# Altium schematic sheet DE-130817_02.SchDoc: Digital Input & Relay Out
size A3; Author: eldar6776@hotmail.com; DrawnBy: Eldar Dedic; Organization: I-MEDIA GROUP d.o.o.; Address1: Topal Osman Paše 18; Address2: 71000 Sarajevo; Address3: Federacija BiH; Address4: Bosna i Hercegovina; DocumentNumber: DE-130817; Revision: 001
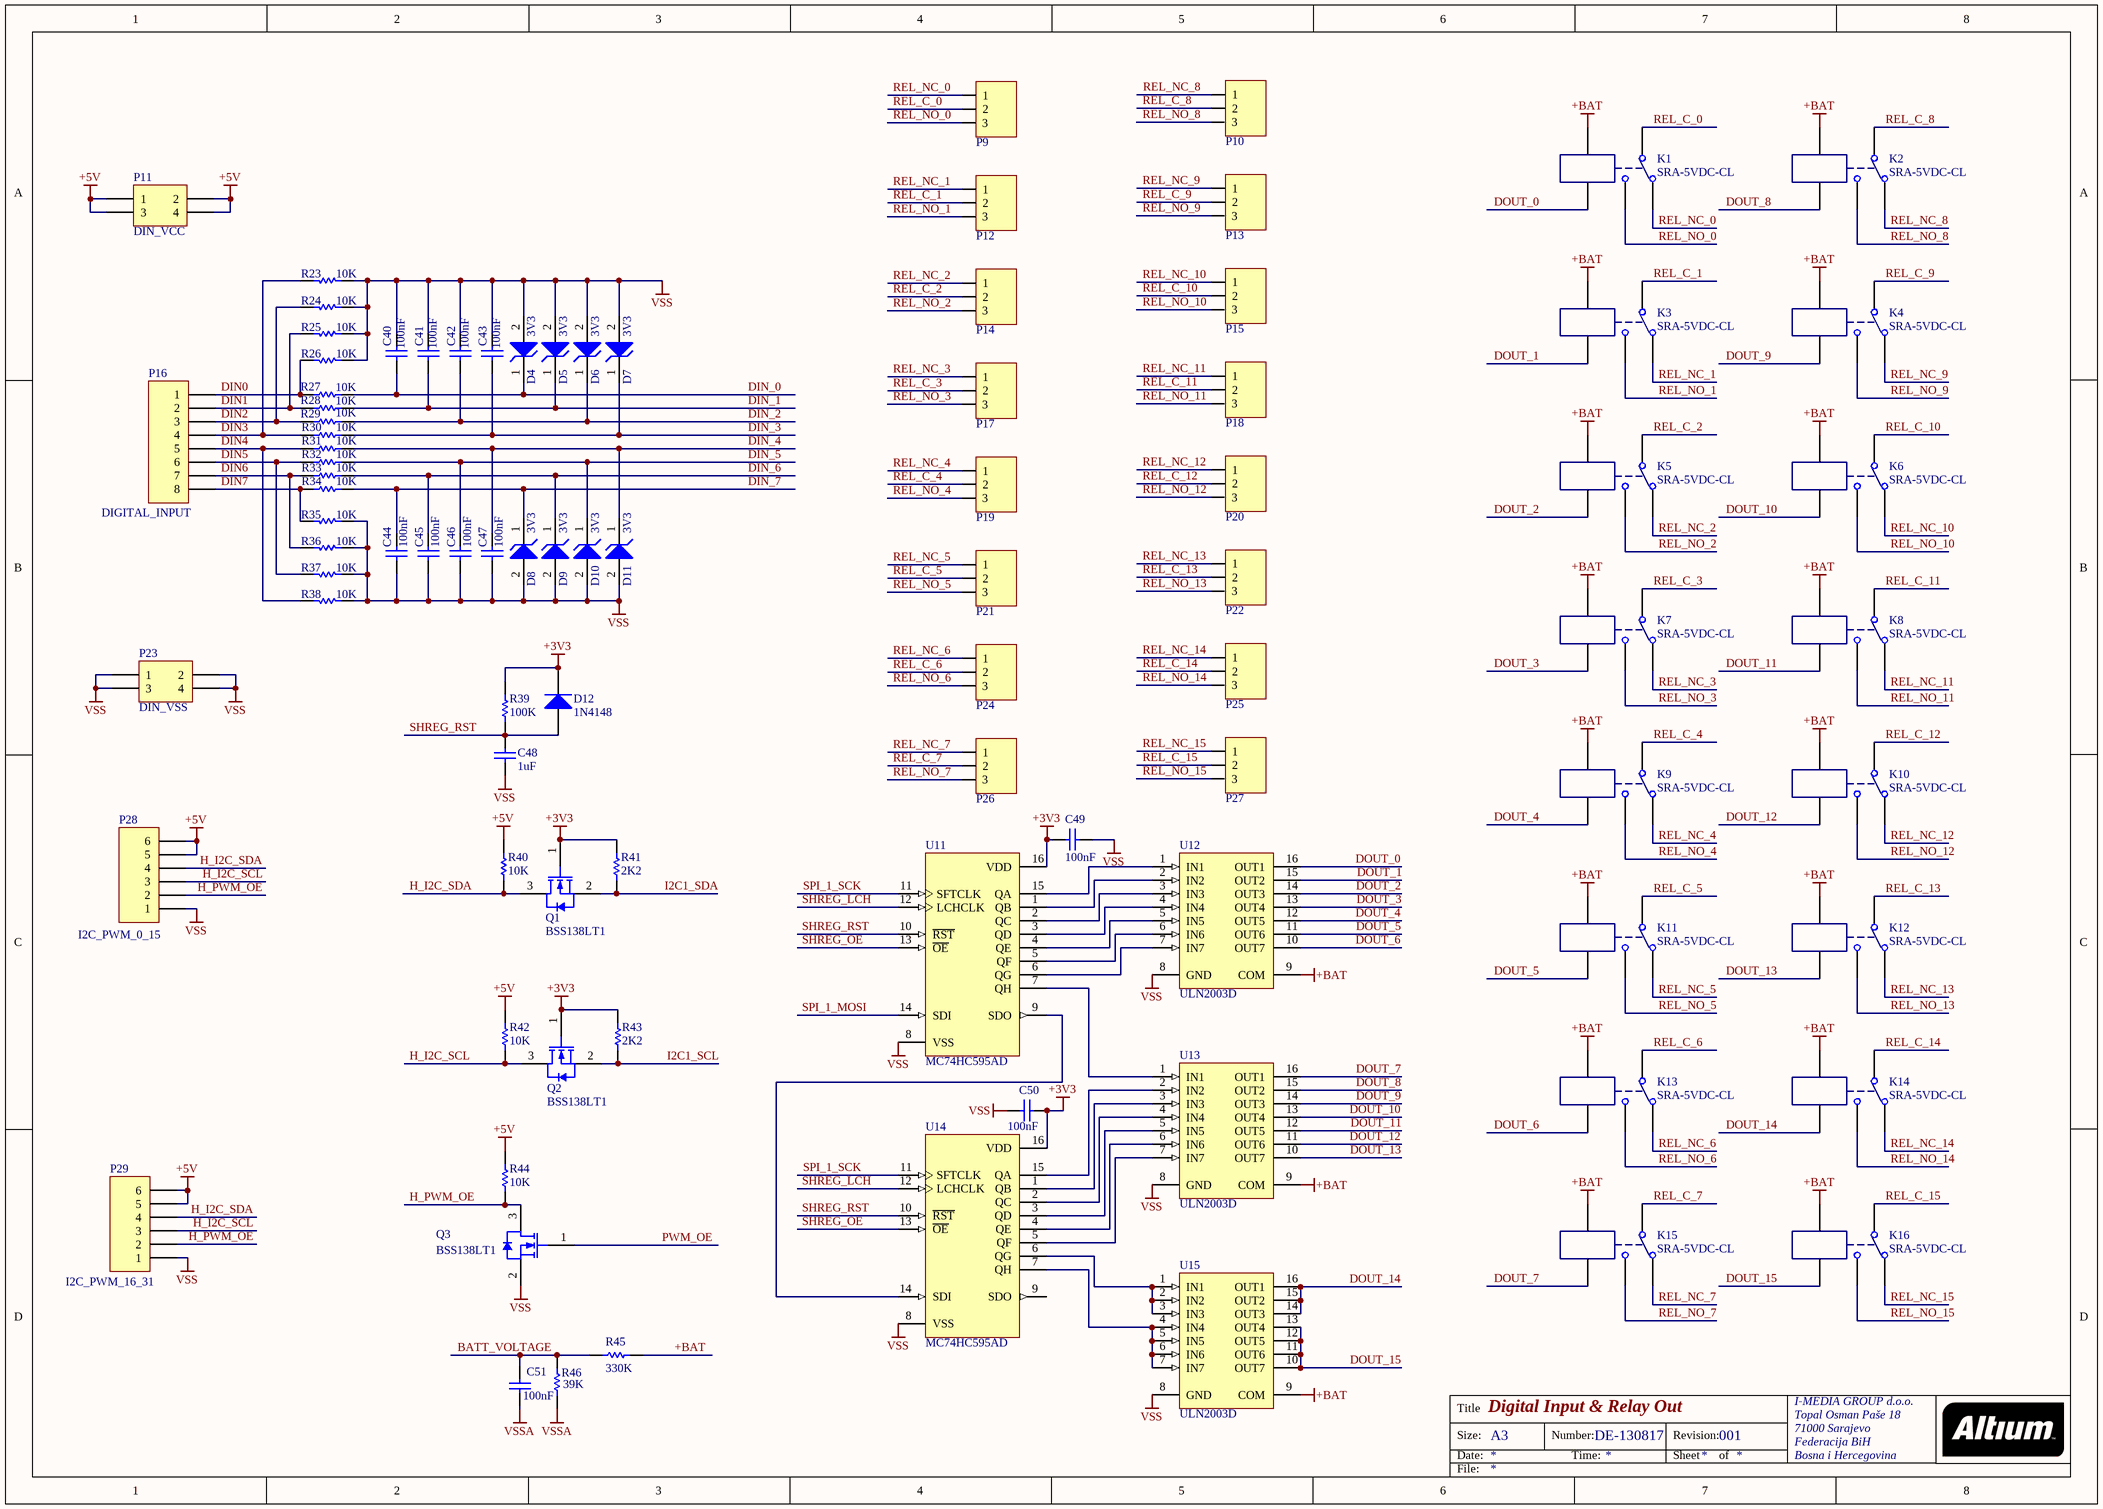
[diagram p0: DE-130817_02.SchDoc]

## Parts
C40  100nF  [0603]
C41  100nF  [0603]
C42  100nF  [0603]
C43  100nF  [0603]
C44  100nF  [0603]
C45  100nF  [0603]
C46  100nF  [0603]
C47  100nF  [0603]
C48  1uF  [0603]
C49  100nF  [0603]
C50  100nF  [0603]
C51  100nF  [0603]
D4  3V3  [ONSC-SOD-323-2-477-02_V]
D5  3V3  [ONSC-SOD-323-2-477-02_V]
D6  3V3  [ONSC-SOD-323-2-477-02_V]
D7  3V3  [ONSC-SOD-323-2-477-02_V]
D8  3V3  [ONSC-SOD-323-2-477-02_V]
D9  3V3  [ONSC-SOD-323-2-477-02_V]
D10  3V3  [ONSC-SOD-323-2-477-02_V]
D11  3V3  [ONSC-SOD-323-2-477-02_V]
D12  1N4148  [SOD323]
K1  SRA-5VDC-CL  [SRA-5VDC-CL]
K2  SRA-5VDC-CL  [SRA-5VDC-CL]
K3  SRA-5VDC-CL  [SRA-5VDC-CL]
K4  SRA-5VDC-CL  [SRA-5VDC-CL]
K5  SRA-5VDC-CL  [SRA-5VDC-CL]
K6  SRA-5VDC-CL  [SRA-5VDC-CL]
K7  SRA-5VDC-CL  [SRA-5VDC-CL]
K8  SRA-5VDC-CL  [SRA-5VDC-CL]
K9  SRA-5VDC-CL  [SRA-5VDC-CL]
K10  SRA-5VDC-CL  [SRA-5VDC-CL]
K11  SRA-5VDC-CL  [SRA-5VDC-CL]
K12  SRA-5VDC-CL  [SRA-5VDC-CL]
K13  SRA-5VDC-CL  [SRA-5VDC-CL]
K14  SRA-5VDC-CL  [SRA-5VDC-CL]
K15  SRA-5VDC-CL  [SRA-5VDC-CL]
K16  SRA-5VDC-CL  [SRA-5VDC-CL]
P9  TERMINAL BLOK 3  [TERMINAL BLOK 3]  (value not drawn)
P10  TERMINAL BLOK 3  [TERMINAL BLOK 3]  (value not drawn)
P11  DIN_VCC  [HDR2X2]
P12  TERMINAL BLOK 3  [TERMINAL BLOK 3]  (value not drawn)
P13  TERMINAL BLOK 3  [TERMINAL BLOK 3]  (value not drawn)
P14  TERMINAL BLOK 3  [TERMINAL BLOK 3]  (value not drawn)
P15  TERMINAL BLOK 3  [TERMINAL BLOK 3]  (value not drawn)
P16  DIGITAL_INPUT  [HDR1X8]
P17  TERMINAL BLOK 3  [TERMINAL BLOK 3]  (value not drawn)
P18  TERMINAL BLOK 3  [TERMINAL BLOK 3]  (value not drawn)
P19  TERMINAL BLOK 3  [TERMINAL BLOK 3]  (value not drawn)
P20  TERMINAL BLOK 3  [TERMINAL BLOK 3]  (value not drawn)
P21  TERMINAL BLOK 3  [TERMINAL BLOK 3]  (value not drawn)
P22  TERMINAL BLOK 3  [TERMINAL BLOK 3]  (value not drawn)
P23  DIN_VSS  [HDR2X2]
P24  TERMINAL BLOK 3  [TERMINAL BLOK 3]  (value not drawn)
P25  TERMINAL BLOK 3  [TERMINAL BLOK 3]  (value not drawn)
P26  TERMINAL BLOK 3  [TERMINAL BLOK 3]  (value not drawn)
P27  TERMINAL BLOK 3  [TERMINAL BLOK 3]  (value not drawn)
P28  I2C_PWM_0_15  [HDR1X6]
P29  I2C_PWM_16_31  [HDR1X6]
Q1  BSS138LT1  [ONSC-SOT-23-3-318-08_V]
Q2  BSS138LT1  [ONSC-SOT-23-3-318-08_V]
Q3  BSS138LT1  [ONSC-SOT-23-3-318-08_V]
R23  10K  [ERA-0603]
R24  10K  [ERA-0603]
R25  10K  [ERA-0603]
R26  10K  [ERA-0603]
R27  10K  [ERA-0603]
R28  10K  [ERA-0603]
R29  10K  [ERA-0603]
R30  10K  [ERA-0603]
R31  10K  [ERA-0603]
R32  10K  [ERA-0603]
R33  10K  [ERA-0603]
R34  10K  [ERA-0603]
R35  10K  [ERA-0603]
R36  10K  [ERA-0603]
R37  10K  [ERA-0603]
R38  10K  [ERA-0603]
R39  100K  [ERA-0603]
R40  10K  [ERA-0603]
R41  2K2  [ERA-0603]
R42  10K  [ERA-0603]
R43  2K2  [ERA-0603]
R44  10K  [ERA-0603]
R45  330K  [ERA-0603]
R46  39K  [ERA-0603]
U11  MC74HC595AD  [751B-05_N]
U12  ULN2003D  [SO16_N]
U13  ULN2003D  [SO16_N]
U14  MC74HC595AD  [751B-05_N]
U15  ULN2003D  [SO16_N]

## Nets
+3V3: C49.2 C50.2 D12.1(K) Q1.1(G) Q2.1(G) R39.2 R41.2 R43.2 U11.16(VDD) U14.16(VDD)
+5V: P11.1 P11.2 P11.3 P11.4 P28.5 P28.6 P29.5 P29.6 R40.2 R42.2 R44.2
+BAT: K1.2 K2.2 K3.2 K4.2 K5.2 K6.2 K7.2 K8.2 K9.2 K10.2 K11.2 K12.2 K13.2 K14.2 K15.2 K16.2 R45.2 U12.9(COM) U13.9(COM) U15.9(COM)
VSS: C40.1 C41.1 C42.1 C43.1 C44.1 C45.1 C46.1 C47.1 C48.1 C49.1 C50.1 D4.2(A) D5.2(A) D6.2(A) D7.2(A) D8.2(A) D9.2(A) D10.2(A) D11.2(A) P23.1 P23.2 P23.3 P23.4 P28.1 P29.1 Q3.2(S) R23.1 R24.1 R25.1 R26.1 R35.1 R36.1 R37.1 R38.1 U11.8(VSS) U12.8(GND) U13.8(GND) U14.8(VSS) U15.8(GND)
VSSA: C51.1 R46.1
BATT_VOLTAGE: C51.2 R45.1 R46.2
DIN0: P16.1 R26.2 R27.1
DIN1: P16.2 R25.2 R28.1
DIN2: P16.3 R24.2 R29.1
DIN3: P16.4 R23.2 R30.1
DIN4: P16.5 R31.1 R38.2
DIN5: P16.6 R32.1 R37.2
DIN6: P16.7 R33.1 R36.2
DIN7: P16.8 R34.1 R35.2
DIN_0: C40.2 D4.1(K) R27.2
DIN_1: C41.2 D5.1(K) R28.2
DIN_2: C42.2 D6.1(K) R29.2
DIN_3: C43.2 D7.1(K) R30.2
DIN_4: C47.2 D11.1(K) R31.2
DIN_5: C46.2 D10.1(K) R32.2
DIN_6: C45.2 D9.1(K) R33.2
DIN_7: C44.2 D8.1(K) R34.2
DOUT_0: K1.5 U12.16(OUT1)
DOUT_1: K3.5 U12.15(OUT2)
DOUT_2: K5.5 U12.14(OUT3)
DOUT_3: K7.5 U12.13(OUT4)
DOUT_4: K9.5 U12.12(OUT5)
DOUT_5: K11.5 U12.11(OUT6)
DOUT_6: K13.5 U12.10(OUT7)
DOUT_7: K15.5 U13.16(OUT1)
DOUT_8: K2.5 U13.15(OUT2)
DOUT_9: K4.5 U13.14(OUT3)
DOUT_10: K6.5 U13.13(OUT4)
DOUT_11: K8.5 U13.12(OUT5)
DOUT_12: K10.5 U13.11(OUT6)
DOUT_13: K12.5 U13.10(OUT7)
DOUT_14: K14.5 U15.14(OUT3) U15.15(OUT2) U15.16(OUT1)
DOUT_15: K16.5 U15.10(OUT7) U15.11(OUT6) U15.12(OUT5) U15.13(OUT4)
H_I2C_SCL: P28.3 P29.3 Q2.3(D) R42.1
H_I2C_SDA: P28.4 P29.4 Q1.3(D) R40.1
H_PWM_OE: P28.2 P29.2 Q3.3(D) R44.1
I2C1_SCL: Q2.2(S) R43.1
I2C1_SDA: Q1.2(S) R41.1
PWM_OE: Q3.1(G)
REL_C_0: K1.1 P9.2
REL_C_1: K3.1 P12.2
REL_C_2: K5.1 P14.2
REL_C_3: K7.1 P17.2
REL_C_4: K9.1 P19.2
REL_C_5: K11.1 P21.2
REL_C_6: K13.1 P24.2
REL_C_7: K15.1 P26.2
REL_C_8: K2.1 P10.2
REL_C_9: K4.1 P13.2
REL_C_10: K6.1 P15.2
REL_C_11: K8.1 P18.2
REL_C_12: K10.1 P20.2
REL_C_13: K12.1 P22.2
REL_C_14: K14.1 P25.2
REL_C_15: K16.1 P27.2
REL_NC_0: K1.4 P9.1
REL_NC_1: K3.4 P12.1
REL_NC_2: K5.4 P14.1
REL_NC_3: K7.4 P17.1
REL_NC_4: K9.4 P19.1
REL_NC_5: K11.4 P21.1
REL_NC_6: K13.4 P24.1
REL_NC_7: K15.4 P26.1
REL_NC_8: K2.4 P10.1
REL_NC_9: K4.4 P13.1
REL_NC_10: K6.4 P15.1
REL_NC_11: K8.4 P18.1
REL_NC_12: K10.4 P20.1
REL_NC_13: K12.4 P22.1
REL_NC_14: K14.4 P25.1
REL_NC_15: K16.4 P27.1
REL_NO_0: K1.3 P9.3
REL_NO_1: K3.3 P12.3
REL_NO_2: K5.3 P14.3
REL_NO_3: K7.3 P17.3
REL_NO_4: K9.3 P19.3
REL_NO_5: K11.3 P21.3
REL_NO_6: K13.3 P24.3
REL_NO_7: K15.3 P26.3
REL_NO_8: K2.3 P10.3
REL_NO_9: K4.3 P13.3
REL_NO_10: K6.3 P15.3
REL_NO_11: K8.3 P18.3
REL_NO_12: K10.3 P20.3
REL_NO_13: K12.3 P22.3
REL_NO_14: K14.3 P25.3
REL_NO_15: K16.3 P27.3
SHREG_LCH: U11.12(LCHCLK) U14.12(LCHCLK)
SHREG_OE: U11.13(~{OE}) U14.13(~{OE})
SHREG_RST: C48.2 D12.2(A) R39.1 U11.10(~{RST}) U14.10(~{RST})
SPI_1_MOSI: U11.14(SDI)
SPI_1_SCK: U11.11(SFTCLK) U14.11(SFTCLK)
NetU11_1: U11.1(QB) U12.2(IN2)
NetU11_2: U11.2(QC) U12.3(IN3)
NetU11_3: U11.3(QD) U12.4(IN4)
NetU11_4: U11.4(QE) U12.5(IN5)
NetU11_5: U11.5(QF) U12.6(IN6)
NetU11_6: U11.6(QG) U12.7(IN7)
NetU11_7: U11.7(QH) U13.1(IN1)
NetU11_9: U11.9(SDO) U14.14(SDI)
NetU11_15: U11.15(QA) U12.1(IN1)
NetU13_2: U13.2(IN2) U14.15(QA)
NetU13_3: U13.3(IN3) U14.1(QB)
NetU13_4: U13.4(IN4) U14.2(QC)
NetU13_5: U13.5(IN5) U14.3(QD)
NetU13_6: U13.6(IN6) U14.4(QE)
NetU13_7: U13.7(IN7) U14.5(QF)
NetU14_6: U14.6(QG) U15.1(IN1) U15.2(IN2) U15.3(IN3)
NetU14_7: U14.7(QH) U15.4(IN4) U15.5(IN5) U15.6(IN6) U15.7(IN7)

Not connected (* = marked no-connect by the designer): U14 9(SDO)

## Notes on the sheet
- Title
- Size:
- Date:
- A3
- Number:
- Time:
- Revision:
- Sheet
- of
- File:

## Library data of the parts
C40-C51 = C0603: Ceramic Chip Capacitor - Standard; Note: Footprint corresponds to dimensions for bulk cassette packaging. This case size has tightened tolerances.; Published: 17-Jul-2002; LatestRevisionDate: 19-Mar-2004; LatestRevisionNote: Silkscreen size reduced.; DatasheetDocument: Mar-2001; PackageDocument: Mar-2001; PackageReference: 0603; Publisher: Altium Limited; Code_JEITA: 0603; Code_IPC: 1608 [0603]; ComponentLink1Description: Manufacturer Link; ComponentLink1URL: http://www.kemet.com/; ComponentLink2Description: Datasheet; ComponentLink2URL: http://www.kemet.com/kemet/web/homepage/kechome.nsf/vapubfilesname/F3102TA.pdf/$file/F3102TA.pdf
D4-D11 = MM3Z33VT1G: Zener Voltage Regulator, 300 mW, 2-Pin SOD-323, Pb-Free, Tape and Reel; Manufacturer: On Semiconductor; P Max (W): 0.3; VZ Typ (V): 33; DatasheetVersion: Rev. 9; PackageVersion: Rev. H, 03/2007; PackageReference: SOD-323-2-477-02; PackageDescription: 2-Pin SOD, Body 1.7 x 1.25 mm; Supplier 1: Digi-Key; Supplier Part Number 1: MM3Z33VT1GOSTR-ND; Supplier 2: Digi-Key; Supplier Part Number 2: MM3Z33VT1GOSCT-ND; Supplier 3: Digi-Key; Supplier Part Number 3: MM3Z33VT1GOSDKR-ND; Supplier 4: Farnell; Supplier Part Number 4: 1431197RL; Supplier 5: Farnell; Supplier Part Number 5: 1431197; Supplier 6: Newark; Supplier Part Number 6: 98H0837; Supplier 7: Mouser; Supplier Part Number 7: 863-MM3Z33VT1G; Packing: Tape and Reel; RoHS: Pb-Free; Mounting Technology: Surface Mount; PartNumber: MM3Z33VT1G; ComponentLink1Description: Manufacturer URL; ComponentLink1URL: http://www.onsemi.com/; ComponentLink2Description: Datasheet; ComponentLink2URL: http://www.onsemi.cn/pub_link/Collateral/MM3Z2V4T1-D.PDF; ComponentLink3Description: Package Specification; ComponentLink3URL: http://www.onsemi.com/pub_link/Collateral/477-02.PDF.1
D12 = BAS321: General-purpose Diode; Published: 17-Sep-2003; LatestRevisionDate: 19-Mar-2004; LatestRevisionNote: Silkscreen size reduced.; DatasheetVersion: 9-Feb-1999; PackageVersion: May-1999; PackageReference: SOD323; Publisher: Altium Limited; PackageDescription: SOD-323/SC-76; 2 Leads; Body 1.7 x 1.3 mm, (LxW); ComponentLink1Description: Manufacturer Link; ComponentLink1URL: http://www.semiconductors.philips.com/; ComponentLink2Description: Datasheet; ComponentLink2URL: http://www.semiconductors.philips.com/acrobat/datasheets/BAS321_2.pdf
K1-K16 = SRA-5VDC-CL: SPDT PCB relay 5Vdc coil
P9 P10 P12-P15 P17-P22 P24-P27 = TERMINAL BLOK 3: 3 pinski terminal blok konektor
P11 P23 = Header 2X2: Header, 2-Pin, Dual row; LatestRevisionDate: 17-Jul-2002; LatestRevisionNote: Re-released for DXP Platform.; Publisher: Altium Limited
P16 = Header 8: Header, 8-Pin; LatestRevisionDate: 17-Jul-2002; LatestRevisionNote: Re-released for DXP Platform.; Publisher: Altium Limited
P28 P29 = Header 6: Header, 6-Pin; LatestRevisionDate: 17-Jul-2002; LatestRevisionNote: Re-released for DXP Platform.; Publisher: Altium Limited
Q1-Q3 = BSS138LT1: Power MOSFET, 200 mA, 50 V, N-Channel, 3-Pin SOT-23, Tape and Reel; Manufacturer: On Semiconductor; Channel Polarity: N Channel; Ciss Typ (pF): 40; Configuration: Single; Coss Typ (pF): 12; Crss Typ (pF): 3.5; ID Max (A): 0.2; PD Max (W): 0.225; V(BR)DSS Min (V): 50; VGS Max (V): 20; VGS(th) Max (V): 1.5; DatasheetVersion: Rev. 8; PackageVersion: Rev. AP, 11/2009; PackageReference: SOT-23-3-318-08; PackageDescription: 3-Pin Small Outline Transistor, Body 2.92 x 1.3 mm, Pitch 0.95 mm; Supplier 1: Digi-Key; Supplier Part Number 1: BSS138LT1OSCT-ND; Package Type: SOT-23-3; Packing: Tape and Reel; Mounting Technology: Surface Mount; PartNumber: BSS138LT1; ComponentLink1Description: Manufacturer URL; ComponentLink1URL: http://www.onsemi.com/; ComponentLink2Description: Datasheet; ComponentLink2URL: http://www.onsemi.com/pub_link/Collateral/BSS138LT1-D.PDF; ComponentLink3Description: Package Specification; ComponentLink3URL: http://www.onsemi.cn/pub_link/Collateral/318-08.PDF
R23-R46 = ERAV: Metal Film Thermosensitive Chip Resistor, 0.56 Ohm to 10k Ohm Range, 5% Tolerance, 0603 Size, 0.063 W; Note: If flow soldering, adjust pad width of PCB Footprint to 0.7 - 0.8 times the width of the resistor.; Published: 17-Dec-2003; LatestRevisionDate: 19-Mar-2004; LatestRevisionNote: Silkscreen size reduced.; PackageDocument: Mar-2003; PackageReference: ERA-0603; Publisher: Altium Limited; Code_IPC: 1608 [0603]; ComponentLink1Description: Manufacturer Link; ComponentLink1URL: http://www.panasonic.com/industrial/components/resistive_products.htm; ComponentLink2Description: Datasheet; ComponentLink2URL: http://www.panasonic.com/industrial/components/pdf/AOF0000CE1.pdf
U11 U14 = MC74HC595AD: 8-Bit Serial-Input/Serial or Prallel-Output Shift Register with Latched 3-State Outputs; Published: 15-Apr-2002; LatestRevisionDate: 13-Apr-2006; LatestRevisionNote: IPC-7351 Footprint Added.; DatasheetVersion: Mar-2000; PackageVersion: Oct-1999; PackageReference: 751B-05; Publisher: Altium Limited; PackageDescription: 16-Pin Small Outline Integrated Circuit 1.27 mm Pitch; Code_JEDEC: MS-012-AC; Code_IPC: SOIC127P600-16; ComponentLink1Description: Manufacturer Link; ComponentLink1URL: http://www.onsemi.com/; ComponentLink2Description: Datasheet; ComponentLink2URL: http://www.onsemi.com/pub/Collateral/MC74HC595A-D.PDF
U12 U13 U15 = ULN2003D: Seven Darlington Array; Published: 8-Jun-2000; LatestRevisionDate: 13-Apr-2006; LatestRevisionNote: IPC-7351 Footprint Added.; DatasheetVersion: Sep-1998; PackageVersion: May-1998; PackageReference: SO16; Publisher: Altium Limited; PackageDescription: 16-Pin Small Outline Integrated Circuit 1.27 mm Pitch; Code_IPC: SOIC127P600-16; ComponentLink1Description: Manufacturer Link; ComponentLink1URL: http://www.st.com/; ComponentLink2Description: Datasheet; ComponentLink2URL: http://www.st.com/stonline/products/literature/ds/5279/uln2001.pdf